# EAGLE schematic untitled (EAGLE 7.6.0)
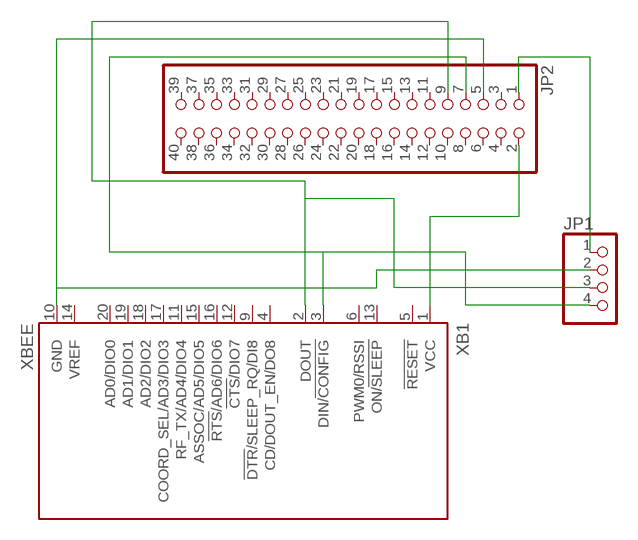
[diagram p0: schematic, sheet 1]

## Parts
JP1  PINHD-1X4  [1X04]
JP2  PINHD-2X20  [2X20]
XB1  XBEE  [XBEE]

## Nets
N$1: JP2.2 XB1.1(VCC)
N$2: JP1.2 JP2.5 XB1.10(GND)
N$4: JP1.3 JP2.9 XB1.2(DOUT)
N$5: JP1.1 JP2.1
N$6: JP1.4 JP2.7 XB1.3(DIN/!CONFIG)
Unconnected: JP2.3 JP2.4 JP2.6 JP2.8 JP2.10 JP2.11 JP2.12 JP2.13 JP2.14 JP2.15 JP2.16 JP2.17 JP2.18 JP2.19 JP2.20 JP2.21 JP2.22 JP2.23 JP2.24 JP2.25 JP2.26 JP2.27 JP2.28 JP2.29 JP2.30 JP2.31 JP2.32 JP2.33 JP2.34 JP2.35 JP2.36 JP2.37 JP2.38 JP2.39 JP2.40 XB1.4(CD/DOUT_EN/DO8) XB1.5(!RESET) XB1.6(PWM0/RSSI) XB1.9(!DTR!/SLEEP_RQ/DI8) XB1.11(RF_TX/AD4/DIO4) XB1.12(!CTS!/DIO7) XB1.13(ON/!SLEEP) XB1.14(VREF) XB1.15(ASSOC/AD5/DIO5) XB1.16(!RTS!/AD6/DIO6) XB1.17(COORD_SEL/AD3/DIO3) XB1.18(AD2/DIO2) XB1.19(AD1/DIO1) XB1.20(AD0/DIO0)

## Library data of the parts
JP1 = pinhead:PINHD-1X4: PIN HEADER
JP2 = pinhead:PINHD-2X20: PIN HEADER
XB1 = maxstream:XBEE: XBee (TM) /XBee-PRO(TM) OEM RF Modules Source: MaxStream, Inc. xbee_productmanual.pdf; MPN: XBP24-Z7UIT-004; OC_FARNELL: 1751799; OC_NEWARK: 34R5507